# EAGLE design LPC_4TE_3.42taster4x2 (EAGLE 5.00)
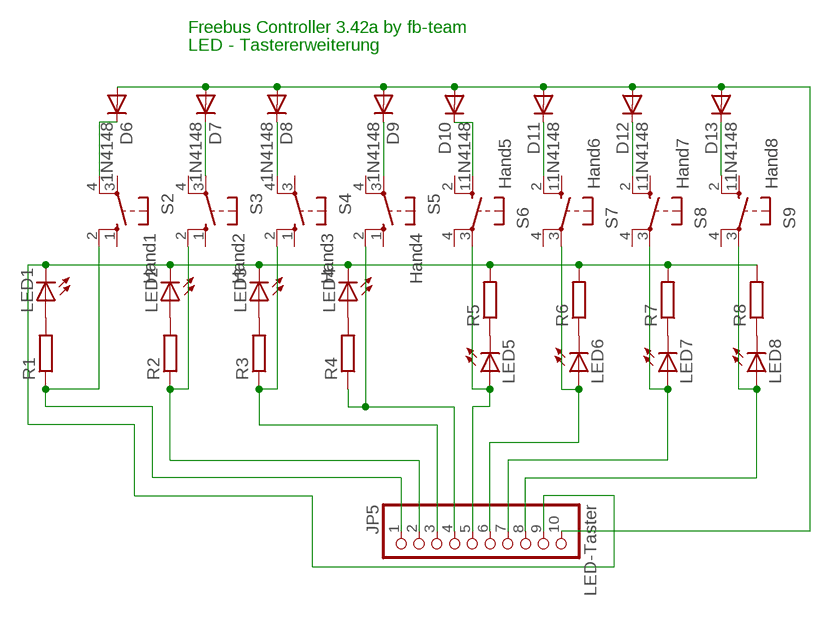
[diagram p0: schematic, sheet 1]

## Parts
D6  1N4148  [DO35-10]
D7  1N4148  [DO35-10]
D8  1N4148  [DO35-10]
D9  1N4148  [DO35-10]
D10  1N4148  [DO35-10]
D11  1N4148  [DO35-10]
D12  1N4148  [DO35-10]
D13  1N4148  [DO35-10]
JP5  LED-Taster  PINHD-1X10  [1X10]
LED1  LED3MM  [LED3MM]
LED2  LED3MM  [LED3MM]
LED3  LED3MM  [LED3MM]
LED4  LED3MM  [LED3MM]
LED5  LED3MM  [LED3MM]
LED6  LED3MM  [LED3MM]
LED7  LED3MM  [LED3MM]
LED8  LED3MM  [LED3MM]
R1  R-EU_0204/7  [0204/7]
R2  R-EU_0204/7  [0204/7]
R3  R-EU_0204/7  [0204/7]
R4  R-EU_0204/7  [0204/7]
R5  R-EU_0204/7  [0204/7]
R6  R-EU_0204/7  [0204/7]
R7  R-EU_0204/7  [0204/7]
R8  R-EU_0204/7  [0204/7]
S2  Hand1  10-XX  [B3F-10XX]
S3  Hand2  10-XX  [B3F-10XX]
S4  Hand3  10-XX  [B3F-10XX]
S5  Hand4  10-XX  [B3F-10XX]
S6  Hand5  10-XX  [B3F-10XX]
S7  Hand6  10-XX  [B3F-10XX]
S8  Hand7  10-XX  [B3F-10XX]
S9  Hand8  10-XX  [B3F-10XX]

## Nets
GND: JP5.9 LED1.K(C) LED2.K(C) LED3.K(C) LED4.K(C) R5.2 R6.2 R7.2 R8.2
N$1: D6.C S2.4(P1)
N$2: JP5.1 R1.1 S2.2(S1)
N$3: JP5.7 LED7.A S8.3(P)
N$4: D10.C S6.1(S)
N$5: D13.C S9.2(S1)
N$6: D8.C S4.4(P1)
N$7: D9.C S5.3(P)
N$9: D11.C S7.2(S1)
N$10: D12.C S8.2(S1)
N$11: D7.C S3.3(P)
N$12: JP5.5 LED5.A S6.3(P)
N$14: JP5.3 R3.1 S4.2(S1)
N$15: LED5.K(C) R5.1
N$16: LED6.K(C) R6.1
N$17: LED7.K(C) R7.1
N$18: LED8.K(C) R8.1
N$20: JP5.4 R4.1 S5.2(S1)
N$21: JP5.6 LED6.A S7.3(P)
N$22: LED1.A R1.2
N$23: LED2.A R2.2
N$24: JP5.8 LED8.A S9.3(P)
N$26: LED3.A R3.2
N$30: JP5.2 R2.1 S3.2(S1)
N$31: LED4.A R4.2
T_MUX: D6.A D7.A D8.A D9.A D10.A D11.A D12.A D13.A JP5.10
Unconnected: S2.1(S) S2.3(P) S3.1(S) S3.4(P1) S4.1(S) S4.3(P) S5.1(S) S5.4(P1) S6.2(S1) S6.4(P1) S7.1(S) S7.4(P1) S8.1(S) S8.4(P1) S9.1(S) S9.4(P1)

## Notes on the sheet
- Freebus Controller 3.42a by fb-team
- LED - Tastererweiterung

## Library data of the parts
D6-D13 = diode:1N4148: DIODE high speed (Philips)
JP5 = pinhead:PINHD-1X10: PIN HEADER
LED1-LED8 = led:LED: LED OSRAM: - CHIPLED LG R971, LG N971, LY N971, LG Q971, LY Q971, LO R971, LY R971 LH N974, LH R974 LS Q976, LO Q976, LY Q976 LO Q996 - Hyper CHIPLED LW Q18S LB Q993, LB Q99A, LB R99A - SideLED LS A670, LO A670, LY A670, LG A670, LP A670 LB A673, LV A673, LT A673, LW A673 LH A674 LY A675 LS A676, LA A676, LO A676, LY A676, LW A676 LS A679, LY A679, LG A679 - Hyper Micro SIDELED® LS Y876, LA Y876, LO Y876, LY Y876 LT Y87S - SmartLED LW L88C, LW L88S LB L89C, LB L89S, LG L890 LS L89K, LO L89K, LY L89K LS L896, LA L896, LO L896, LY L896 - TOPLED LS T670, LO T670, LY T670, LG T670, LP T670 LSG T670, LSP T670, LSY T670, LOP T670, LYG T670 LG T671, LOG T671, LSG T671 LB T673, LV T673, LT T673, LW T673 LH T674 LS T676, LA T676, LO T676, LY T676, LB T676, LH T676, LSB T676, LW T676 LB T67C, LV T67C, LT T67C, LS T67K, LO T67K, LY T67K, LW E67C LS E67B, LA E67B, LO E67B, LY E67B, LB E67C, LV E67C, LT E67C LW T67C LS T679, LY T679, LG T679 LS T770, LO T770, LY T770, LG T770, LP T770 LB T773, LV T773, LT T773, LW T773 LH T774 LS E675, LA E675, LY E675, LS T675 LS T776, LA T776, LO T776, LY T776, LB T776 LHGB T686 LT T68C, LB T68C - Hyper Mini TOPLED® LB M676 - Mini TOPLED Santana® LG M470 LS M47K, LO M47K, LY M47K Source: http://www.osram.convergy.de - LUMILED® LXK2-PW12-R00, LXK2-PW12-S00, LXK2-PW14-U00, LXK2-PW14-V00 LXK2-PM12-R00, LXK2-PM12-S00, LXK2-PM14-U00 LXK2-PE12-Q00, LXK2-PE12-R00, LXK2-PE12-S00, LXK2-PE14-T00, LXK2-PE14-U00 LXK2-PB12-K00, LXK2-PB12-L00, LXK2-PB12-M00, LXK2-PB14-N00, LXK2-PB14-P00, LXK2-PB14-Q00 LXK2-PR12-L00, LXK2-PR12-M00, LXK2-PR14-Q00, LXK2-PR14-R00 LXK2-PD12-Q00, LXK2-PD12-R00, LXK2-PD12-S00 LXK2-PH12-R00, LXK2-PH12-S00 LXK2-PL12-P00, LXK2-PL12-Q00, LXK2-PL12-R00 Source: www.luxeon.com
R1-R8 = rcl:R-EU_: RESISTOR, European symbol
S2-S9 = switch-omron:10-XX: OMRON SWITCH

## Board
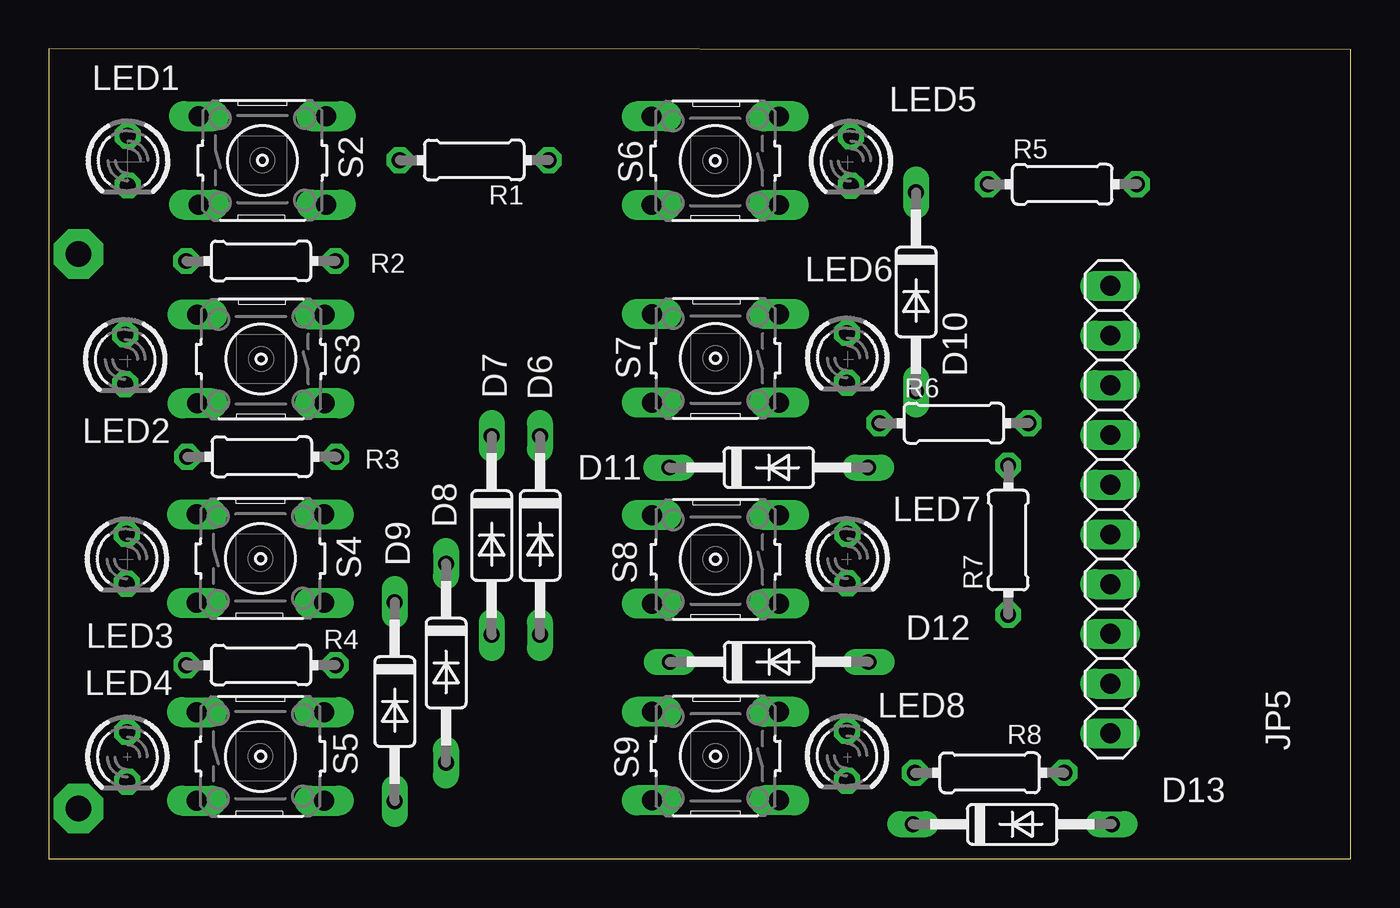
[diagram p1: board, top side]
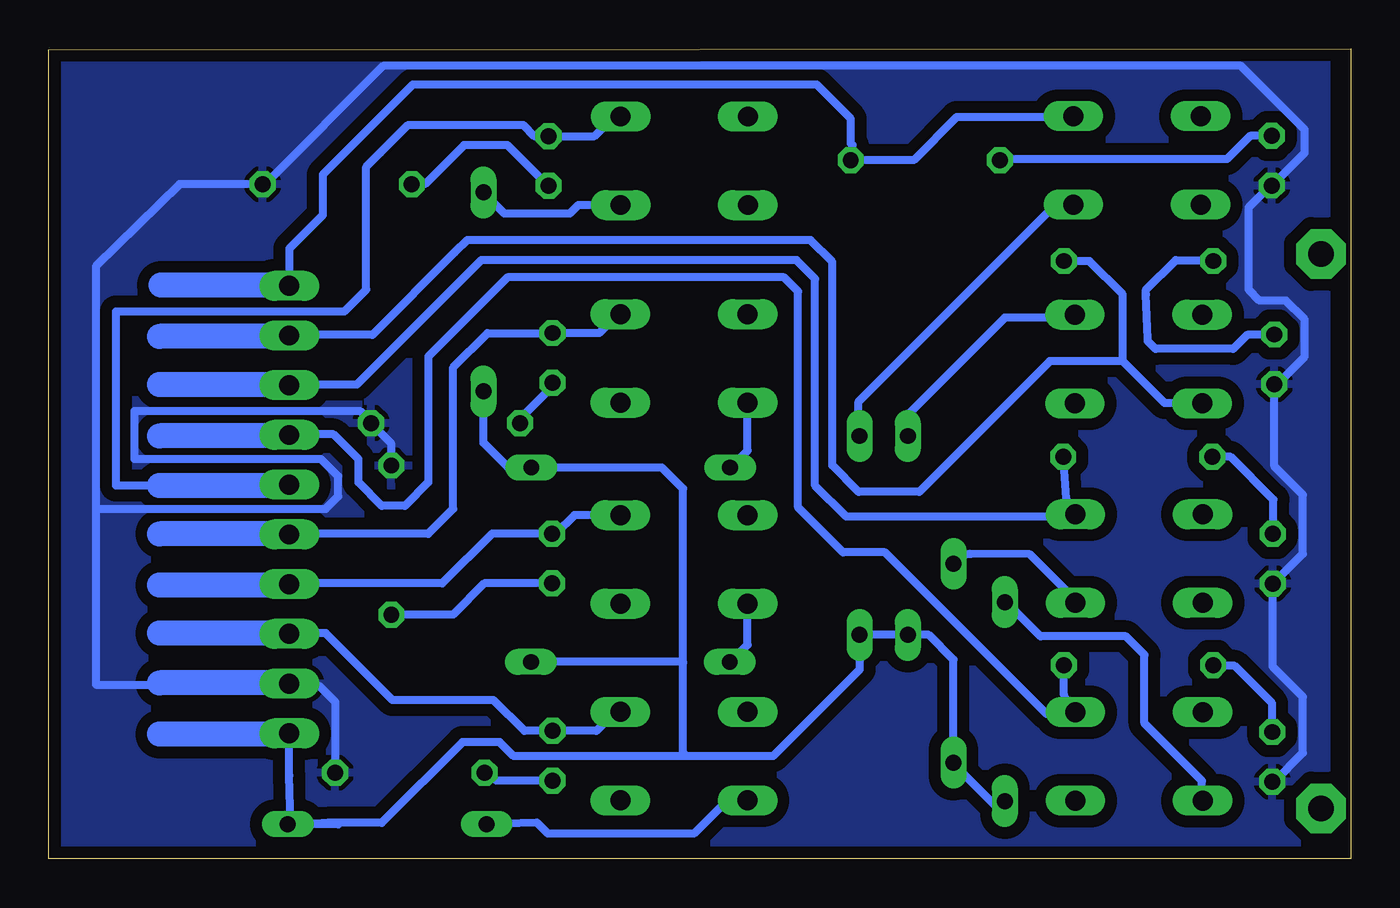
[diagram p2: board, bottom side, seen from below]

Size 66.5 x 41.35 mm. Coordinates in mm from the lower left corner, seen from the top.
Outline: 0,0 66.5,0 66.5,41.3 0,41.35 0,0
Copper layers (1*16): Top 0.035mm / dielectric 1.5mm / Bottom 0.035mm
Design rules "default *": minimum track width 10mil, minimum drill 24mil, track to track 12mil, track to pad 12mil, pad to pad 12mil, via to via 12mil, smd to smd 8mil, copper to edge 20mil, drill to drill 8mil, minimum pad ring 10mil, minimum via ring 8mil, stop-mask expansion 4mil, vias tented up to drill 0mil, thermal gap 10mil

### Footprints (pad centres in the part's own frame; a part is rotated, then mirrored left to right if it is on the bottom)
DO35-10 = drill 0.813 long: A 5.08,0; C -5.08,0
1X10 = drill 1.016 long: 1 -11.43,0; 2 -8.89,0; 3 -6.35,0; 4 -3.81,0; 5 -1.27,0; 6 1.27,0; 7 3.81,0; 8 6.35,0; 9 8.89,0; 10 11.43,0
LED3MM = drill 0.813 octagon: A -1.27,0; K 1.27,0
0204/7 = drill 0.813 octagon: 1 -3.81,0; 2 3.81,0
B3F-10XX = drill 1.016 long: 1 -3.251,2.261; 2 3.251,2.261; 3 -3.251,-2.261; 4 3.251,-2.261

### Placement (x,y rotation side)
D6  25.09,16.5 270 top
D7  22.62,16.5 270 top
D8  20.29,9.98 270 top
D9  17.67,8.02 270 top
D10  44.3,28.94 270 top
D11  36.78,19.97 0 top
D12  36.8,10.04 0 top
D13  49.22,1.75 0 top
JP5  54.22,17.82 270 top
LED1  4.03,35.64 270 top
LED2  3.89,25.5 270 top
LED3  3.98,15.31 270 top
LED4  4,5.2 270 top
LED5  40.97,35.63 270 top
LED6  40.78,25.57 270 top
LED7  40.8,15.32 270 top
LED8  40.77,5.25 270 top
R1  21.73,35.67 180 top
R2  10.83,30.52 180 top
R3  10.87,20.52 180 top
R4  10.83,9.88 180 top
R5  51.77,34.44 0 top
R6  46.24,22.24 0 top
R7  49.01,16.26 90 top
R8  48.06,4.38 0 top
S2  10.91,35.66 0 top
S3  10.83,25.52 180 top
S4  10.81,15.32 0 top
S5  10.81,5.22 0 top
S6  34.04,35.64 180 top
S7  34.05,25.55 180 top
S8  34.05,15.28 180 top
S9  34.05,5.24 180 top

### Tracks (layer width: path | path; a pad name or v marks a point on that pad's centre or on a via)
GND
  Bottom 0.406: R8.2 51.87,8.01 52.67,8.81 54.1,8.81 JP5.9 54.26,8.93 54.26,8.89 | R7.2 49.02,20.09 49.02,21.22 R6.2 50.05,22.3 50.61,22.86 62.12,22.86 62.12,20.4 52.59,20.4 51.72,19.53 51.72,18.5 52.36,17.86 64.1,17.86 | 64.1,17.86 64.1,30.24 59.83,34.44 55.68,34.44 55.61,34.37 55.58,34.4 R5.2 55.46,34.44 49.42,40.48 5.61,40.48 2.35,37.23 2.35,36.04 4.02,34.37 LED1.K 4.09,34.37 5.21,33.26 5.21,29.05 4.65,28.5 3.3,28.5 2.35,27.54 2.35,25.64 3.78,24.21 3.8,24.23 LED2.K 3.89,20.04 2.43,18.57 2.43,15.56 3.94,14.05 | 64.1,17.86 64.1,8.89 54.26,8.89 | 54.26,8.89 54.26,8.81 | LED3.K 3.98,9.8 2.43,8.26 2.43,5.4 3.9,3.93 LED4.K
  pour Bottom (isolate 0.61): 0.92,41.44 1.24,41.12 1.24,0.24 1.4,0.4 65.77,0.4 65.77,41.28
N$1
  Bottom 0.406: S2.4 14.24,33.4 14.26,33.42 14.34,33.34 15.13,33.34 25.13,23.34 25.13,21.59 25.12,21.58 D6.C
N$2
  Bottom 0.406: 14.16,38.44 S2.2 14.12,37.92 | JP5.1 54.22,31.16 52.52,32.86 52.52,34.93 47.91,39.53 27.27,39.53 25.53,37.78 25.53,36.51 25.45,36.43 25.46,36.43 R1.1 22.32,35.67 20.13,37.86 14.18,37.86 14.12,37.92 | 14.12,37.92 14.1,37.94
N$3
  Bottom 0.406: S8.3 39.66,17.54 40.61,16.59 LED7.A 43.86,16.59 46.4,14.05 54.26,14.05 JP5.7
N$4
  Bottom 0.406: S6.1 39.46,33.38 39.9,32.94 43.23,32.94 D10.C
N$5
  Bottom 0.406: S9.2 31.84,2.98 33.55,1.27 41.01,1.27 41.57,1.83 D13.C
N$6
  Bottom 0.406: 14.06,13.14 S4.4 14.06,13.22 16.38,15.54 19.42,15.56 19.87,15.48 D8.C
N$7
  Bottom 0.406: D9.C 17.11,12.62 15.84,11.35 11.48,11.35 10.53,10.4 10.53,6.91 7.59,3.97 7.57,3.44 S5.3
N$8
  Bottom 1.27: 54.26,29.29 60.77,29.29
N$9
  Bottom 0.406: D11.C 31.67,19.97 30.8,20.84 S7.2
N$10
  Bottom 0.406: D12.C 31.68,10.04 30.8,10.92 S8.2
N$11
  Bottom 0.406: S3.3 14.17,27.78 14.26,27.86 14.5,27.62 17.67,27.62 22.62,22.68 D7.C
N$12
  Bottom 0.406: S6.3 37.55,37.9 37.59,37.94 38.64,36.9 LED5.A 41.71,36.9 42.28,37.47 48.15,37.47 49.58,36.04 50.29,35.32 50.29,29.05 51.4,27.94 63.07,27.94 63.07,19.05 60.85,19.05 | JP5.5 54.18,19.05 54.26,19.05
  Bottom 1.27: 54.26,19.05 60.85,19.05
N$13
  Bottom 1.27: 54.26,21.59 60.85,21.59
N$14
  Bottom 0.406: 14.22,17.58 14.26,17.54 | 14.22,17.58 S4.2 14.18,17.7 13.94,17.46 25.77,17.46 27.35,19.05 27.35,29.61 28.31,30.56 44.42,30.56 50.77,24.21 54.18,24.21 | R3.1 14.52,18.39 14.22,17.58 | 54.18,24.21 JP5.3 54.18,24.21 | 54.18,24.21 54.1,24.13
N$15
  Bottom 0.406: 41.31,34.36 LED5.K 40.99,34.36 43.07,36.43 45.29,36.43 47.28,34.44 R5.1
N$16
  Bottom 0.406: R6.1 42.29,22.64 42.28,22.62 40.78,24.12 LED6.K
N$17
  Bottom 0.406: LED7.K 44.26,14.05 45.85,12.46 47.91,12.46 48.08,12.45 R7.1
N$18
  Bottom 0.406: R8.1 43.8,4.14 43.64,3.98 LED8.K
N$19
  Bottom 1.27: 54.26,24.21 60.85,24.21 | 60.85,24.21
N$20
  Bottom 0.406: S5.2 14.08,7.46 | 14.06,7.34 14.1,7.3 | S5.2 14.06,7.34 | R4.1 14.64,8.35 14.06,7.34 | S5.2 14.06,7.5 14.18,7.62 14.26,7.54 | S5.2 14.16,7.48 14.26,7.38 15.53,7.38 23.78,15.64 25.92,15.64 28.23,17.94 28.23,28.97 28.94,29.69 43.07,29.69 47.12,25.64 47.12,19.21 48.31,18.02 49.5,18.02 50.69,19.21 50.69,20.4 51.96,21.67 54.18,21.67 JP5.4
N$21
  Bottom 0.406: LED6.A 40.77,26.83 | LED6.A 38.37,26.84 37.41,27.81 S7.3 | LED6.A 44.09,26.84 45.85,25.08 45.85,17.86 47.12,16.59 54.18,16.59 JP5.6
  Bottom 1.27: 54.18,16.59 60.85,16.59
N$22
  Bottom 0.406: R1.2 17.8,35.67 17.67,35.8 17.51,35.72 6.32,35.72 5.13,36.91 4.02,36.91 LED1.A
N$23
  Bottom 0.406: 7.02,30.63 7.03,30.64 | 7.02,30.63 R2.2 | 6.95,30.56 8.94,30.56 10.45,29.05 10.45,28.81 10.37,26.51 10.37,26.43 9.97,26.04 6,26.04 5.29,26.75 3.94,26.75 3.92,26.77 LED2.A | 6.95,30.56 | 6.95,30.56 7.02,30.63
N$24
  Bottom 0.406: S9.3 37.56,7.5 38.53,6.52 LED8.A 42.21,6.52 43.78,8.1 48.94,8.1 52.36,11.51 54.18,11.51 JP5.8
  Bottom 1.27: 54.18,11.51 60.85,11.51
N$25
  Bottom 1.27: 54.26,26.67 60.85,26.67
N$26
  Bottom 0.406: R3.2 6.12,20.52 3.94,18.34 3.94,16.75 3.98,16.71 LED3.A
N$27  (via drill 1.3 pad 2.54)
  other vias: 1.51,30.88
N$28  (via drill 1.3 pad 2.54)
  other vias: 1.51,2.55
N$29
  Bottom 1.27: 54.18,13.97 60.85,13.97
N$30
  Bottom 0.406: JP5.2 54.18,26.75 49.98,26.75 45.77,30.96 45.13,31.59 27.59,31.59 26.48,30.48 26.48,20.08 25.13,18.73 22.04,18.73 15.37,25.4 11.64,25.4 | 14.68,30.56 R2.1 13.34,30.52 11.64,28.81 11.64,25.4 | S3.2 7.59,23.25 9.49,23.26 11.64,25.4 | 11.64,25.4
N$31
  Bottom 0.406: LED4.A 4,7.92 5.92,9.84 6.88,9.84 6.91,9.88 R4.2
N$33
  Bottom 1.27: 54.26,8.97 60.85,8.97
N$35
  Bottom 1.27: 54.18,6.35 60.85,6.35
T_MUX
  Bottom 0.406: 54.14,1.78 51.72,1.75 | 54.14,1.78 D13.A 51.73,1.83 52.28,1.83 49.5,1.83 45.37,5.95 43.47,5.95 42.75,5.24 34.02,5.24 | JP5.10 54.22,4.25 54.14,1.78 | 34.02,5.24 29.5,5.24 25.09,9.65 D6.A 24.98,11.42 24.97,11.43 24.96,11.42 21.55,11.42 | 34.02,5.24 34.02,5.32 34.1,5.4 34.1,10 | 34.1,10 34.1,18.89 35.18,19.97 D11.A 41.88,20 43.07,20 44.3,21.23 D10.A | D12.A 34.14,10.04 34.1,10 | 20.35,4.9 20.53,5.08 | 20.35,4.9 D8.A 20.29,10.16 21.55,11.42 | D9.A 17.83,2.38 20.35,4.9 | 21.55,11.42 22.83,11.43 | 21.55,11.42 D7.A